# Altium schematic sheet CM4_HighSpeed.SchDoc
size A4; DocumentNumber: 3; SheetNumber: 3
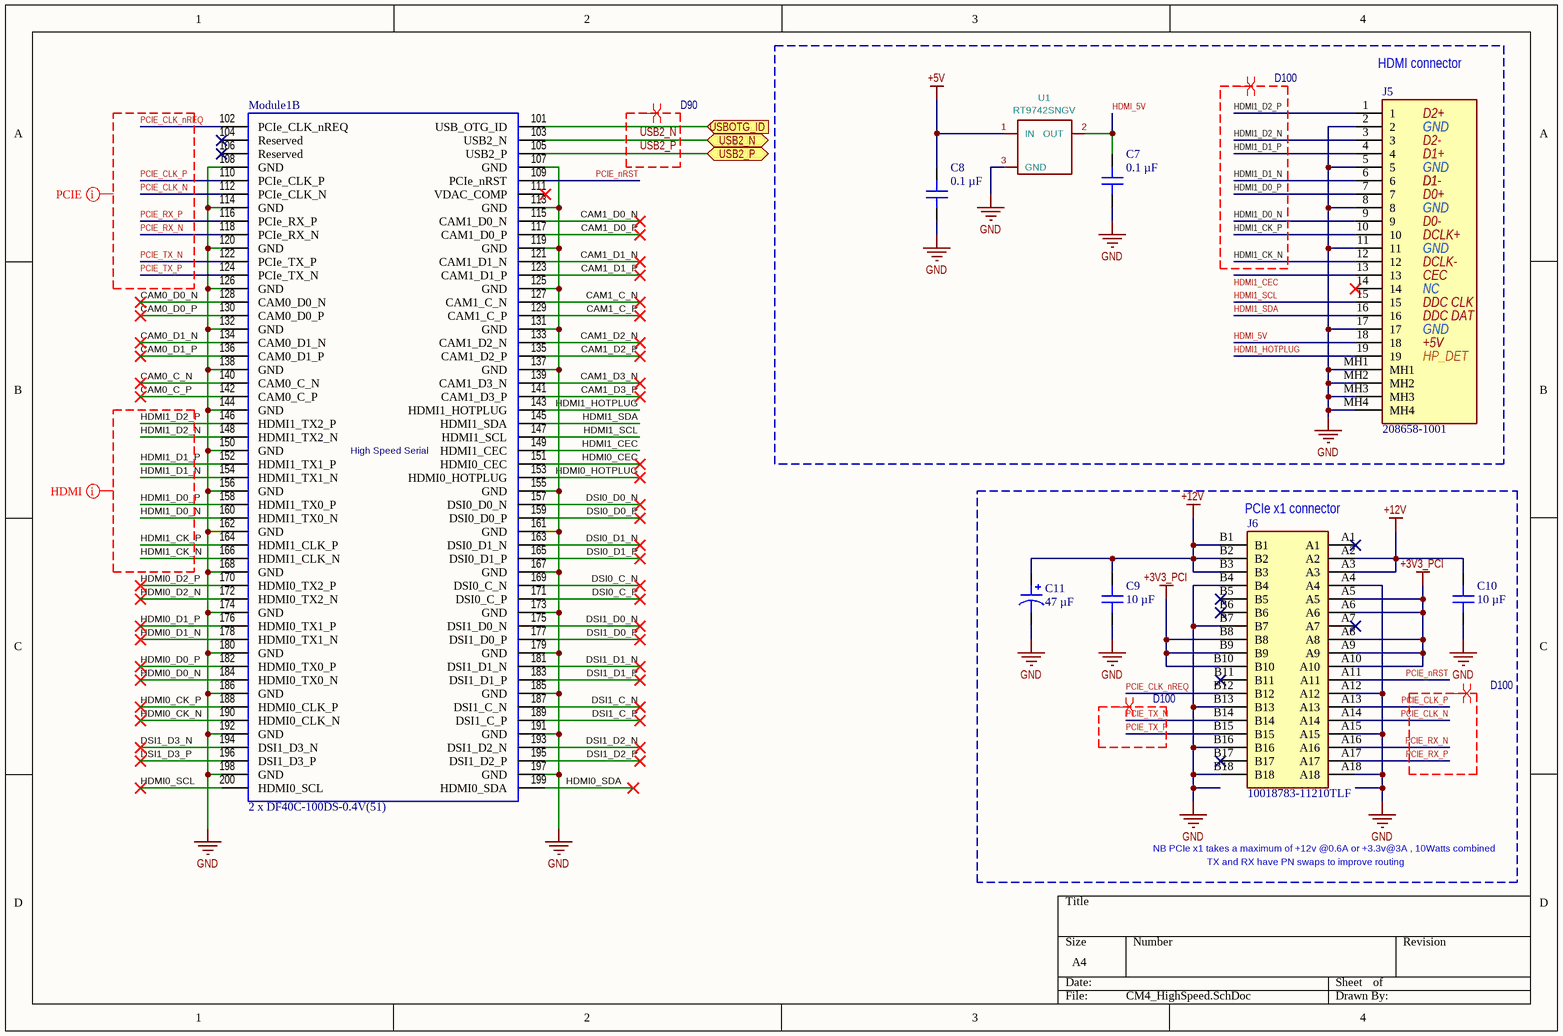
[diagram p0: CM4_HighSpeed.SchDoc]

## Parts
C7  0.1 µF  [CAP 0603_1608]
C8  0.1 µF  [CAP 0603_1608]
C9  10 µF  [CAP 0805_2012]
C10  10 µF  [CAP 0805_2012]
C11  47 µF  [CAP POL 2917_7343]
J5  208658-1001  [2086581001]
J6  10018783-11210TLF  [1001878311210TLF]
Module1  2 x DF40C-100DS-0.4V(51)  [RPI_CM4_STACKED]  (part B of 2)
U1  RT9742SNGV  [SOT-23]

## Blocks framed on the sheet
HDMI connector: C7 C8 J5 U1
PCIe x1 connector: C9-C11 J6

## Ports
USB2_N (bidir, see GrandMini_v1[6B], USB2-HUB[1B]), USB2_P (bidir, see GrandMini_v1[6B], USB2-HUB[1B]), USBOTG_ID (in, see GrandMini_v1[6B])

## Nets
+3V3_PCI: J6.A5 J6.A6 J6.A8 J6.A9 J6.A10 J6.B8 J6.B9 J6.B10
+5V: C8.2 U1.1(IN)
+12V: C9.2 C10.2 C11.1 J6.A2 J6.A3 J6.B1 J6.B2 J6.B3
GND: C7.1 C8.1 C9.1 C10.1 C11.2 J5.2 J5.5 J5.8 J5.11 J5.17 J5.MH1 J5.MH2 J5.MH3 J5.MH4 J6.A4 J6.A12 J6.A15 J6.A18 J6.B4 J6.B7 J6.B13 J6.B16 J6.B18 Module1.107(GND) Module1.108(GND) Module1.113(GND) Module1.114(GND) Module1.119(GND) Module1.120(GND) Module1.125(GND) Module1.126(GND) Module1.131(GND) Module1.132(GND) Module1.137(GND) Module1.138(GND) Module1.144(GND) Module1.150(GND) Module1.155(GND) Module1.156(GND) Module1.161(GND) Module1.162(GND) Module1.167(GND) Module1.168(GND) Module1.173(GND) Module1.174(GND) Module1.179(GND) Module1.180(GND) Module1.185(GND) Module1.186(GND) Module1.191(GND) Module1.192(GND) Module1.197(GND) Module1.198(GND) U1.3(GND)
CAM0_C_N: Module1.140(CAM0_C_N)
CAM0_C_P: Module1.142(CAM0_C_P)
CAM0_D0_N: Module1.128(CAM0_D0_N)
CAM0_D0_P: Module1.130(CAM0_D0_P)
CAM0_D1_N: Module1.134(CAM0_D1_N)
CAM0_D1_P: Module1.136(CAM0_D1_P)
CAM1_C_N: Module1.127(CAM1_C_N)
CAM1_C_P: Module1.129(CAM1_C_P)
CAM1_D0_N: Module1.115(CAM1_D0_N)
CAM1_D0_P: Module1.117(CAM1_D0_P)
CAM1_D1_N: Module1.121(CAM1_D1_N)
CAM1_D1_P: Module1.123(CAM1_D1_P)
CAM1_D2_N: Module1.133(CAM1_D2_N)
CAM1_D2_P: Module1.135(CAM1_D2_P)
CAM1_D3_N: Module1.139(CAM1_D3_N)
CAM1_D3_P: Module1.141(CAM1_D3_P)
DSI0_C_N: Module1.169(DSI0_C_N)
DSI0_C_P: Module1.171(DSI0_C_P)
DSI0_D0_N: Module1.157(DSI0_D0_N)
DSI0_D0_P: Module1.159(DSI0_D0_P)
DSI0_D1_N: Module1.163(DSI0_D1_N)
DSI0_D1_P: Module1.165(DSI0_D1_P)
DSI1_C_N: Module1.187(DSI1_C_N)
DSI1_C_P: Module1.189(DSI1_C_P)
DSI1_D0_N: Module1.175(DSI1_D0_N)
DSI1_D0_P: Module1.177(DSI1_D0_P)
DSI1_D1_N: Module1.181(DSI1_D1_N)
DSI1_D1_P: Module1.183(DSI1_D1_P)
DSI1_D2_N: Module1.193(DSI1_D2_N)
DSI1_D2_P: Module1.195(DSI1_D2_P)
DSI1_D3_N: Module1.194(DSI1_D3_N)
DSI1_D3_P: Module1.196(DSI1_D3_P)
HDMI0_CEC: Module1.151(HDMI0_CEC)
HDMI0_CK_N: Module1.190(HDMI0_CLK_N)
HDMI0_CK_P: Module1.188(HDMI0_CLK_P)
HDMI0_D0_N: Module1.184(HDMI0_TX0_N)
HDMI0_D0_P: Module1.182(HDMI0_TX0_P)
HDMI0_D1_N: Module1.178(HDMI0_TX1_N)
HDMI0_D1_P: Module1.176(HDMI0_TX1_P)
HDMI0_D2_N: Module1.172(HDMI0_TX2_N)
HDMI0_D2_P: Module1.170(HDMI0_TX2_P)
HDMI0_HOTPLUG: Module1.153(HDMI0_HOTPLUG)
HDMI0_SCL: Module1.200(HDMI0_SCL)
HDMI0_SDA: Module1.199(HDMI0_SDA)
HDMI1_CEC: J5.13 Module1.149(HDMI1_CEC)
HDMI1_CK_N: J5.12 Module1.166(HDMI1_CLK_N)
HDMI1_CK_P: J5.10 Module1.164(HDMI1_CLK_P)
HDMI1_D0_N: J5.9 Module1.160(HDMI1_TX0_N)
HDMI1_D0_P: J5.7 Module1.158(HDMI1_TX0_P)
HDMI1_D1_N: J5.6 Module1.154(HDMI1_TX1_N)
HDMI1_D1_P: J5.4 Module1.152(HDMI1_TX1_P)
HDMI1_D2_N: J5.3 Module1.148(HDMI1_TX2_N)
HDMI1_D2_P: J5.1 Module1.146(HDMI1_TX2_P)
HDMI1_HOTPLUG: J5.19 Module1.143(HDMI1_HOTPLUG)
HDMI1_SCL: J5.15 Module1.147(HDMI1_SCL)
HDMI1_SDA: J5.16 Module1.145(HDMI1_SDA)
HDMI_5V: C7.2 J5.18 U1.2(OUT)
PCIE_CLK_N: J6.A14 Module1.112(PCIe_CLK_N)
PCIE_CLK_nREQ: J6.B12 Module1.102(PCIe_CLK_nREQ)
PCIE_CLK_P: J6.A13 Module1.110(PCIe_CLK_P)
PCIE_nRST: J6.A11 Module1.109(PCIe_nRST)
PCIE_RX_N: J6.A16 Module1.118(PCIe_RX_N)
PCIE_RX_P: J6.A17 Module1.116(PCIe_RX_P)
PCIE_TX_N: J6.B14 Module1.122(PCIe_TX_P)
PCIE_TX_P: J6.B15 Module1.124(PCIe_TX_N)
USB2_N: Module1.103(USB2_N) ; port USB2_N
USB2_P: Module1.105(USB2_P) ; port USB2_P
USBOTG_ID: Module1.101(USB_OTG_ID) ; port USBOTG_ID

Not connected (* = marked no-connect by the designer): J5 14*; J6 A1* A7* B5* B6* B11* B17*; Module1 104(Reserved)* 106(Reserved)* 111(VDAC_COMP)*

## Layout directives
differential pair; differential pair class D100: HDMI1_CK_N, HDMI1_CK_P, HDMI1_D0_N, HDMI1_D0_P, HDMI1_D1_N, HDMI1_D1_P, HDMI1_D2_N, HDMI1_D2_P, PCIE_CLK_N, PCIE_CLK_P, PCIE_RX_N, PCIE_RX_P, PCIE_TX_N, PCIE_TX_P
differential pair; differential pair class D90: USB2_N, USB2_P
net class PCIE: PCIE_CLK_N, PCIE_CLK_nREQ, PCIE_CLK_P, PCIE_RX_N, PCIE_RX_P, PCIE_TX_N, PCIE_TX_P
net class HDMI: HDMI1_CK_N, HDMI1_CK_P, HDMI1_D0_N, HDMI1_D0_P, HDMI1_D1_N, HDMI1_D1_P, HDMI1_D2_N, HDMI1_D2_P

## Notes on the sheet
- NB PCIe x1 takes a maximum of +12v @0.6A or +3.3v@3A , 10Watts combined
- TX and RX have PN swaps to improve routing
- 1
- 2
- 3
- 4
- 5
- 6
- A
- B
- C
- www.raspberrypi.com <http://www.raspberrypi.com>
- D
- Title: Compute Module 4 IO Board - CM4 - Highspeed
- File: CM4_HighSpeed.kicad_sch
- Sheet: /
- © 2020-2022 Raspberry Pi Ltd (formerly Raspberry Pi (Trading) Ltd.)
- KiCad E.D.A.  kicad (5.1.4)-1
- Size: A4
- Date:
- Rev: 1
- Id: 1/1
- (in symbol 208658-1001) D2+; GND; D2-; D1+; D1-; D0+; D0-; DCLK+; DCLK-; CEC; NC; DDC CLK; DDC DAT; +5V; HP_DET
- (in symbol RPi_CM4_1, part B) High Speed Serial

## Library data of the parts
C7 C8 = CC0603KRX7R9BB104: CAP CER 0.1UF 50V X7R 0603; manufacturer: Yageo; Tolerance: ±10%; Value: 0.1 µF; Part Number: CC0603KRX7R9BB104; Applications: General Purpose; Capacitance: 0.1 µF; componentlink1description: Datasheet; componentlink1url: https://www.yageo.com/upload/media/product/productsearch/datasheet/mlcc/UPY-GPHC_X7R_6.3V-to-50V_18.pdf; componentlink2description: DigiKey Link; componentlink2url: https://www.digikey.com/en/products/detail/yageo/CC0603KRX7R9BB104/2103082; Device Package: 0603 (1608 Metric); lastupdated: 09.02.2024 20:10:21; Lifecycle Status: Active; Minimum Order: 1; Mounting Type: Surface Mount, MLCC; Operating Temperature: -55°C ~ 125°C; Package / Case: 0603 (1608 Metric); packaging: TapeAndReel; partid: 9506; Part Status: Active; price: 0.01; series: CC; Size / Dimension: 0.063" L x 0.031" W (1.60mm x 0.80mm); Supplier 1: DigiKey; Supplier Part Number 1: 311-1344-1-ND; Temperature Coefficient: X7R; Thickness (Max): 0.035" (0.90mm); Voltage - Rated: 50V
C9 C10 = CC0805KKX5R8BB106: CAP CER 10UF 25V X5R 0805; manufacturer: Yageo; Tolerance: ±10%; Value: 10 µF; Part Number: CC0805KKX5R8BB106; Applications: General Purpose; Capacitance: 10 µF; componentlink1description: Datasheet; componentlink1url: https://www.yageo.com/upload/media/product/productsearch/datasheet/mlcc/UPY-GPHC_X5R_4V-to-50V_25.pdf; componentlink2description: DigiKey Link; componentlink2url: https://www.digikey.com/en/products/detail/yageo/CC0805KKX5R8BB106/5195275; Device Package: 0805 (2012 Metric); lastupdated: 09.02.2024 20:15:28; Lifecycle Status: Active; Minimum Order: 1; Mounting Type: Surface Mount, MLCC; Operating Temperature: -55°C ~ 85°C; Package / Case: 0805 (2012 Metric); packaging: TapeAndReel; partid: 16151; Part Status: Active; price: 0.06; series: CC; Size / Dimension: 0.079" L x 0.049" W (2.00mm x 1.25mm); Supplier 1: DigiKey; Supplier Part Number 1: 311-1869-1-ND; Temperature Coefficient: X5R; Thickness (Max): 0.057" (1.45mm); Voltage - Rated: 25V
C11 = T491X476K035AT: CAP TANT 47UF 10% 35V 2917; manufacturer: KEMET; Manufacturer Size Code: X; ESR (Equivalent Series Resistance): 600mOhm; Lifetime @ Temp.: 2000 Hrs @ 125°C; Type: Molded; Part Number: T491X476K035AT; Value: 47 µF; Capacitance: 47 µF; componentlink1description: Datasheet; componentlink1url: https://api.kemet.com/component-edge/download/datasheet/T491X476K035AT.pdf; componentlink2description: DigiKey Link; componentlink2url: https://www.digikey.com/en/products/detail/kemet/T491X476K035AT/818681; Device Package: 2917 (7343 Metric); Features: General Purpose; Height - Seated (Max): 0.169" (4.30mm); lastupdated: 03.06.2024 19:30:20; Lifecycle Status: Active; Minimum Order: 1; Mounting Type: Surface Mount; Operating Temperature: -55°C ~ 125°C; Package / Case: 2917 (7343 Metric); packaging: TapeAndReel; partid: 3168; Part Status: Active; price: 1.10; series: T491; Size / Dimension: 0.287" L x 0.169" W (7.30mm x 4.30mm); Supplier 1: DigiKey; Supplier Part Number 1: 399-3821-1-ND; Tolerance: ±10%; Voltage - Rated: 35 V
J5 = 208658-1001: Connector, HDMI; Manufacturer_Name: Molex; Datasheet Link: https://componentsearchengine.com/Datasheets/2/208658-1001.pdf; Height: 6.19mm; Manufacturer_Part_Number: 208658-1001; Mouser Part Number: 538-208658-1001; Mouser Price/Stock: https://www.mouser.co.uk/ProductDetail/Molex/208658-1001?qs=B6kkDfuK7%2FCPiHHdkGL5VQ%3D%3D
J6 = 10018783-11210TLF: Connector PCI-E; Manufacturer_Name: Amphenol Communications Solutions; Datasheet Link: https://cdn.amphenol-cs.com/media/wysiwyg/files/drawing/10018783.pdf; Height: 11.25mm; Manufacturer_Part_Number: 10018783-11210TLF
Module1 = RPi_CM4_1: Rapsberry PI Compute Module 4 +
U1 = RT9742SNGV: Part Description: Power Switch/Driver 1:1 N-Channel 500mA SOT-23-3; Field4: Farnell; Field5: 2575555; Field7: RichTek; Field8: USWI00155; Field6: RT9742SNGV; Value: RT9742SNGV; Footprint: Package_TO_SOT_SMD:SOT-23